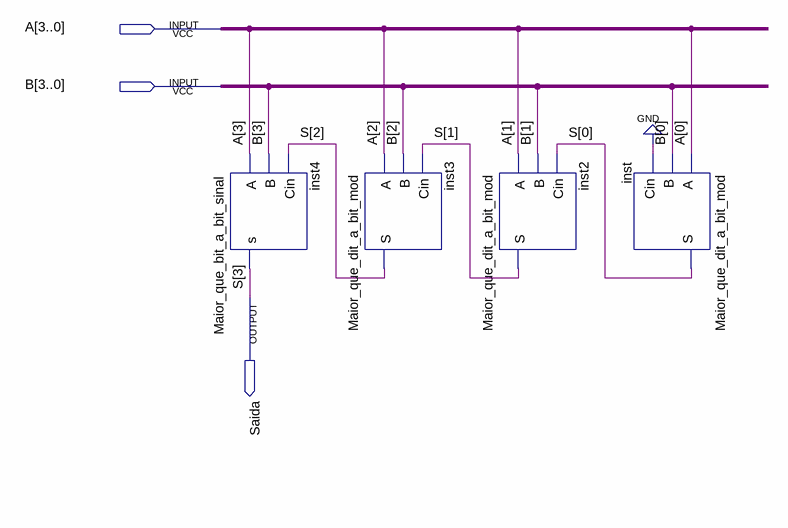
[diagram p0: schematic sheet]
// Quartus schematic Menor_que_completo.bdf as structural Verilog: 4 symbols, 3 pins
module Menor_que_completo (
  input  [3:0] A,
  input  [3:0] B,
  output Saida
);

  wire [2:0] S;

  Maior_que_bit_a_bit_sinal inst4 (.A(A[3]), .B(B[3]), .Cin(S[2]), .s(Saida));
  Maior_que_dit_a_bit_mod inst3 (.A(A[2]), .B(B[2]), .Cin(S[1]), .S(S[2]));
  Maior_que_dit_a_bit_mod inst2 (.A(A[1]), .B(B[1]), .Cin(S[0]), .S(S[1]));
  Maior_que_dit_a_bit_mod inst (.A(A[0]), .B(B[0]), .Cin(1'b0), .S(S[0]));

  // Other names for the same wires on the sheet: S[3] = Saida
endmodule
